# EAGLE design adapters_01_many (EAGLE 4.16)
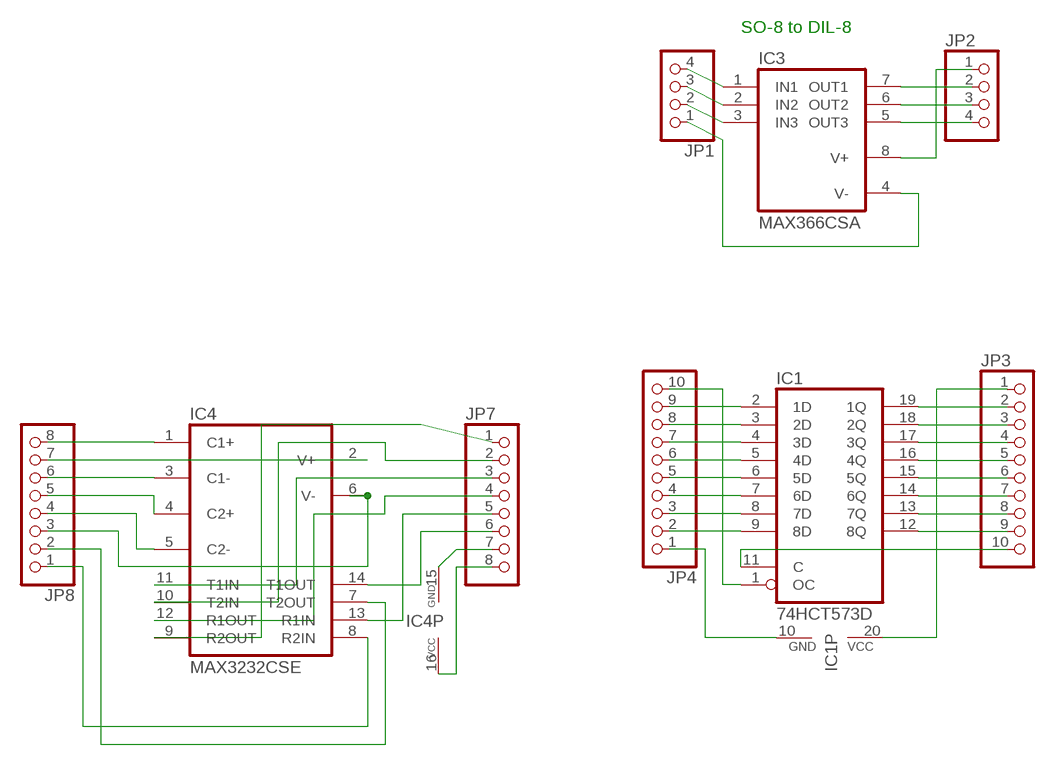
[diagram p0: schematic, sheet 1]

## Parts
IC1  74HCT573D  [SO20W]
IC3  MAX366CSA  [SO08]
IC4  MAX3232CSE  [SO16]
JP1  PINHD-1X4  [1X04]
JP2  PINHD-1X4  [1X04]
JP3  PINHD-1X10  [1X10]
JP4  PINHD-1X10  [1X10]
JP7  PINHD-1X8  [1X08]
JP8  PINHD-1X8  [1X08]

## Nets
N$1: IC3.1(IN1) JP1.4
N$2: IC3.2(IN2) JP1.3
N$3: IC3.3(IN3) JP1.2
N$4: IC3.4(V-) JP1.1
N$5: IC3.5(OUT3) JP2.4
N$6: IC3.6(OUT2) JP2.3
N$7: IC3.7(OUT1) JP2.2
N$8: IC3.8(V+) JP2.1
N$9: IC4.1(C1+) JP8.8
N$10: IC4.3(C1-) JP8.6
N$11: IC4.2(V+) JP8.7
N$12: IC4.4(C2+) JP8.5
N$13: IC4.5(C2-) JP8.4
N$14: IC4.6(V-) JP8.3
N$15: IC4.7(T2OUT) JP8.2
N$16: IC4.8(R2IN) JP8.1
N$17: IC4.16(VCC) JP7.8
N$18: IC4.15(GND) JP7.7
N$19: IC4.14(T1OUT) JP7.6
N$20: IC4.13(R1IN) JP7.5
N$21: IC4.12(R1OUT) JP7.4
N$22: IC4.11(T1IN) JP7.3
N$23: IC4.10(T2IN) JP7.2
N$24: IC4.9(R2OUT) JP7.1
N$25: IC1.2(1D) JP4.9
N$26: IC1.3(2D) JP4.8
N$27: IC1.4(3D) JP4.7
N$28: IC1.5(4D) JP4.6
N$29: IC1.6(5D) JP4.5
N$30: IC1.7(6D) JP4.4
N$31: IC1.8(7D) JP4.3
N$32: IC1.9(8D) JP4.2
N$33: IC1.10(GND) JP4.1
N$34: IC1.1(OC) JP4.10
N$35: IC1.11(C) JP3.10
N$36: IC1.12(8Q) JP3.9
N$37: IC1.13(7Q) JP3.8
N$38: IC1.14(6Q) JP3.7
N$39: IC1.15(5Q) JP3.6
N$40: IC1.16(4Q) JP3.5
N$41: IC1.17(3Q) JP3.4
N$42: IC1.18(2Q) JP3.3
N$43: IC1.19(1Q) JP3.2
N$44: IC1.20(VCC) JP3.1

## Notes on the sheet
- SO-8 to DIL-8

## Library data of the parts
IC1 = 74xx-eu:74*573: 8-bit D latch BUS DRIVER
IC3 = maxim:MAX366CSA: Signal-line CIRCUIT PROTECTOR
IC4 = maxim:MAX3232*: True RS-232 Transceivers 3.0V to 5.5V, Low-Power up to 1Mbps, Using Four 0.1µF External Capacitors Source: http://pdfserv.maxim-ic.com/en/ds/MAX3222-MAX3241.pdf
JP1 JP2 = pinhead:PINHD-1X4: PIN HEADER
JP3 JP4 = pinhead:PINHD-1X10: PIN HEADER
JP7 JP8 = pinhead:PINHD-1X8: PIN HEADER

## Board
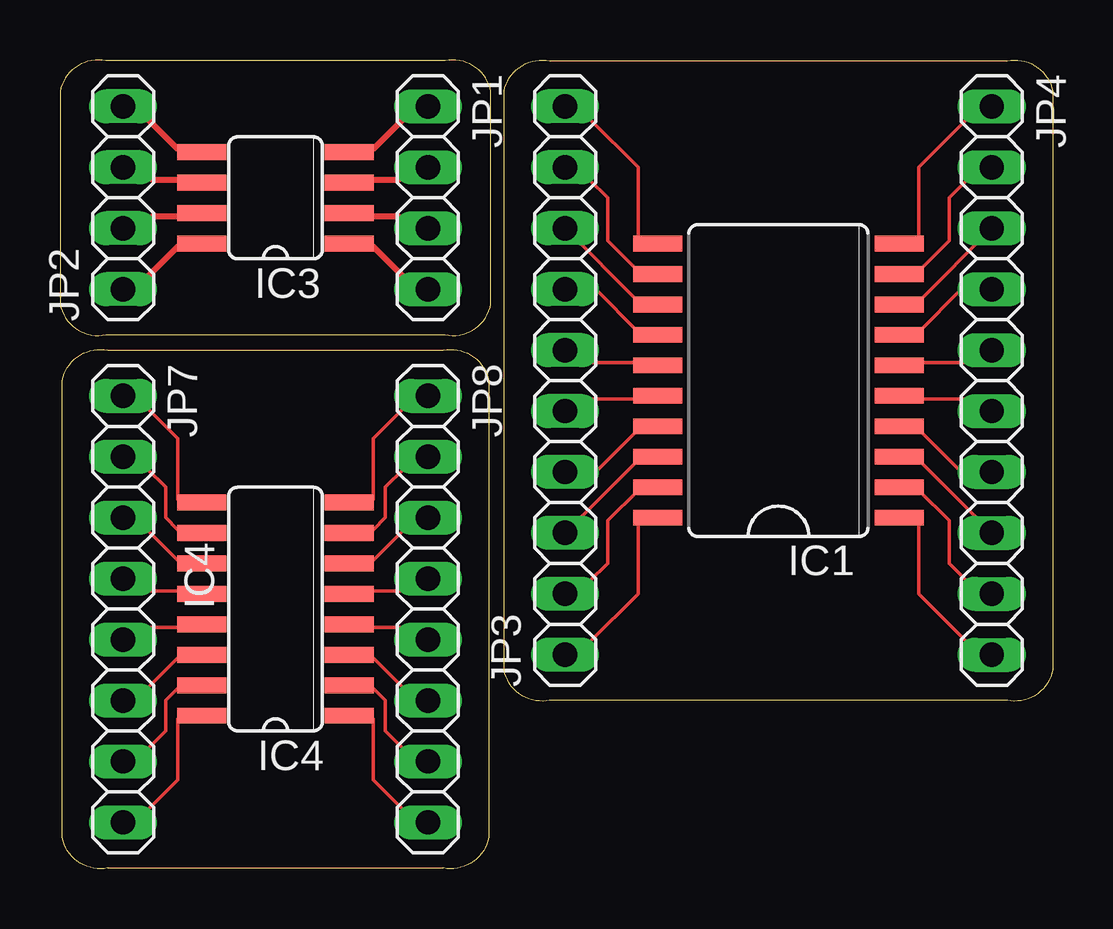
[diagram p1: board, top side]

Size 41.36 x 33.72 mm. Coordinates in mm from the lower left corner, seen from the top.
Outline: 0,23.53 arc90 1.9,22.26 16.05,22.26 arc90 17.96,23.53 17.96,32.41 arc90 16.05,33.68 1.9,33.68 arc90 0,32.41 0,23.53
Outline: 18.5,32.42 arc-90 20.41,33.69 39.46,33.69 arc-90 41.36,32.42 41.36,8.29 arc-90 39.46,7.02 20.41,7.02 arc-90 18.5,8.29 18.5,32.42
Outline: 0.09,20.35 arc-90 1.99,21.62 15.96,21.62 arc-90 17.87,20.35 17.87,1.3 arc-90 15.96,0.03 1.99,0.03 arc-90 0.09,1.3 0.09,20.35
Copper layers (1*16): Top 0.035mm / dielectric 1.5mm / Bottom 0.035mm
Design rules "PCB-POOL": minimum track width 6mil, minimum drill 12mil, track to track 6mil, track to pad 6mil, pad to pad 6mil, via to via 6mil, smd to smd 6mil, copper to edge 20mil, drill to drill 8mil, minimum pad ring 8mil, minimum via ring 6mil, stop-mask expansion 3mil, vias tented up to drill 0mil, thermal gap 8mil

### Footprints (pad centres in the part's own frame; a part is rotated, then mirrored left to right if it is on the bottom)
SO20W = smd 0.66 x 2.032: 1 -5.715,-5.029; 2 -4.445,-5.029; 3 -3.175,-5.029; 4 -1.905,-5.029; 5 -0.635,-5.029; 6 0.635,-5.029; 7 1.905,-5.029; 8 3.175,-5.029; 9 4.445,-5.029; 10 5.715,-5.029; 11 5.715,5.029; 12 4.445,5.029; 13 3.175,5.029; 14 1.905,5.029; 15 0.635,5.029; 16 -0.635,5.029; 17 -1.905,5.029; 18 -3.175,5.029; 19 -4.445,5.029; 20 -5.715,5.029
SO08 = smd 0.66 x 2.032: 1 -1.905,-3.073; 2 -0.635,-3.073; 3 0.635,-3.073; 4 1.905,-3.073; 5 1.905,3.073; 6 0.635,3.073; 7 -0.635,3.073; 8 -1.905,3.073
SO16 = smd 0.66 x 2.032: 1 -4.445,-3.073; 2 -3.175,-3.073; 3 -1.905,-3.073; 4 -0.635,-3.073; 5 0.635,-3.073; 6 1.905,-3.073; 7 3.175,-3.073; 8 4.445,-3.073; 9 4.445,3.073; 10 3.175,3.073; 11 1.905,3.073; 12 0.635,3.073; 13 -0.635,3.073; 14 -1.905,3.073; 15 -3.175,3.073; 16 -4.445,3.073
1X04 = drill 1.016 long: 1 -3.81,0; 2 -1.27,0; 3 1.27,0; 4 3.81,0
1X10 = drill 1.016 long: 1 -11.43,0; 2 -8.89,0; 3 -6.35,0; 4 -3.81,0; 5 -1.27,0; 6 1.27,0; 7 3.81,0; 8 6.35,0; 9 8.89,0; 10 11.43,0
1X08 = drill 1.016 long: 1 -8.89,0; 2 -6.35,0; 3 -3.81,0; 4 -1.27,0; 5 1.27,0; 6 3.81,0; 7 6.35,0; 8 8.89,0

### Placement (x,y rotation side)
IC1  29.93,20.35 90 top
IC3  8.98,27.97 90 top
IC4  8.98,10.83 90 top
JP1  15.33,27.97 270 top
JP2  2.63,27.97 90 top
JP3  21.04,20.35 90 top
JP4  38.82,20.35 270 top
JP7  2.63,10.83 270 top
JP8  15.33,10.83 270 top

### Tracks (layer width: path | path; a pad name or v marks a point on that pad's centre or on a via)
N$1
  Top 0.254: IC3.1 13.04,25.94 14.31,24.67 JP1.4
N$2
  Top 0.254: IC3.2 13.04,27.21 14.06,27.21 JP1.3
N$3
  Top 0.254: IC3.3 13.04,28.73 14.06,28.73 JP1.2
N$4
  Top 0.254: IC3.4 13.04,30 14.31,31.27 JP1.1
N$5
  Top 0.254: IC3.5 4.92,30 3.64,31.27 JP2.4
N$6
  Top 0.254: IC3.6 4.92,28.73 3.9,28.73 JP2.3
N$7
  Top 0.254: IC3.7 4.92,27.21 3.9,27.21 JP2.2
N$8
  Top 0.254: IC3.8 4.92,25.94 3.64,24.67 JP2.1
N$9
  Top 0.152: IC4.1 13.04,6.25 13.04,3.71 14.31,2.44 JP8.8
N$10
  Top 0.152: IC4.3 13.04,8.79 14.31,7.52 JP8.6
N$11
  Top 0.152: IC4.2 13.04,7.52 13.55,7.02 13.55,5.75 14.31,4.98 JP8.7
N$12
  Top 0.152: IC4.4 13.04,10.06 14.31,10.06 JP8.5
N$13
  Top 0.152: IC4.5 13.04,11.59 14.31,11.59 JP8.4
N$14
  Top 0.152: IC4.6 13.04,12.86 14.31,14.13 JP8.3
N$15
  Top 0.152: IC4.7 13.04,14.13 13.55,14.64 13.55,15.91 14.31,16.67 JP8.2
N$16
  Top 0.152: IC4.8 13.04,15.4 13.04,17.94 14.31,19.21 JP8.1
N$17
  Top 0.152: IC4.16 4.92,6.25 4.92,3.71 3.64,2.44 JP7.8
N$18
  Top 0.152: IC4.15 4.92,7.52 4.41,7.02 4.41,5.75 3.64,4.98 JP7.7
N$19
  Top 0.152: IC4.14 4.92,8.79 3.64,7.52 JP7.6
N$20
  Top 0.152: IC4.13 4.92,10.06 3.64,10.06 JP7.5
N$21
  Top 0.152: IC4.12 4.92,11.59 3.64,11.59 JP7.4
N$22
  Top 0.152: IC4.11 4.92,12.86 3.64,14.13 JP7.3
N$23
  Top 0.152: IC4.10 4.92,14.13 4.41,14.64 4.41,15.91 3.64,16.67 JP7.2
N$24
  Top 0.152: IC4.9 4.92,15.4 4.92,17.94 3.64,19.21 JP7.1
N$25
  Top 0.152: IC1.2 35.78,15.78 37.05,14.51 37.05,12.73 37.81,11.97 JP4.9
N$26
  Top 0.152: IC1.3 35.78,17.05 JP4.8
N$27
  Top 0.152: IC1.4 35.78,18.32 37.55,16.54 JP4.7
N$28
  Top 0.152: IC1.5 35.78,19.59 37.81,19.59 JP4.6
N$29
  Top 0.152: IC1.6 35.78,21.11 37.81,21.11 JP4.5
N$30
  Top 0.152: IC1.7 35.78,22.38 37.55,24.16 JP4.4
N$31
  Top 0.152: IC1.8 35.78,23.65 JP4.3
N$32
  Top 0.152: IC1.9 35.78,24.92 37.05,26.19 37.05,27.97 37.81,28.73 JP4.2
N$33
  Top 0.152: IC1.10 35.78,26.19 35.78,29.24 37.81,31.27 JP4.1
N$34
  Top 0.152: IC1.1 35.78,14.51 35.78,11.46 37.81,9.43 JP4.10
N$35
  Top 0.152: IC1.11 24.09,26.19 24.09,29.24 22.06,31.27 JP3.10
N$36
  Top 0.152: IC1.12 24.09,24.92 22.82,26.19 22.82,27.97 22.06,28.73 JP3.9
N$37
  Top 0.152: IC1.13 24.09,23.65 JP3.8
N$38
  Top 0.152: IC1.14 24.09,22.38 22.31,24.16 JP3.7
N$39
  Top 0.152: IC1.15 24.09,21.11 22.06,21.11 JP3.6
N$40
  Top 0.152: IC1.16 24.09,19.59 22.06,19.59 JP3.5
N$41
  Top 0.152: IC1.17 24.09,18.32 22.31,16.54 JP3.4
N$42
  Top 0.152: IC1.18 24.09,17.05 JP3.3
N$43
  Top 0.152: IC1.19 24.09,15.78 22.82,14.51 22.82,12.73 22.06,11.97 JP3.2
N$44
  Top 0.152: IC1.20 24.09,14.51 24.09,11.46 22.06,9.43 JP3.1